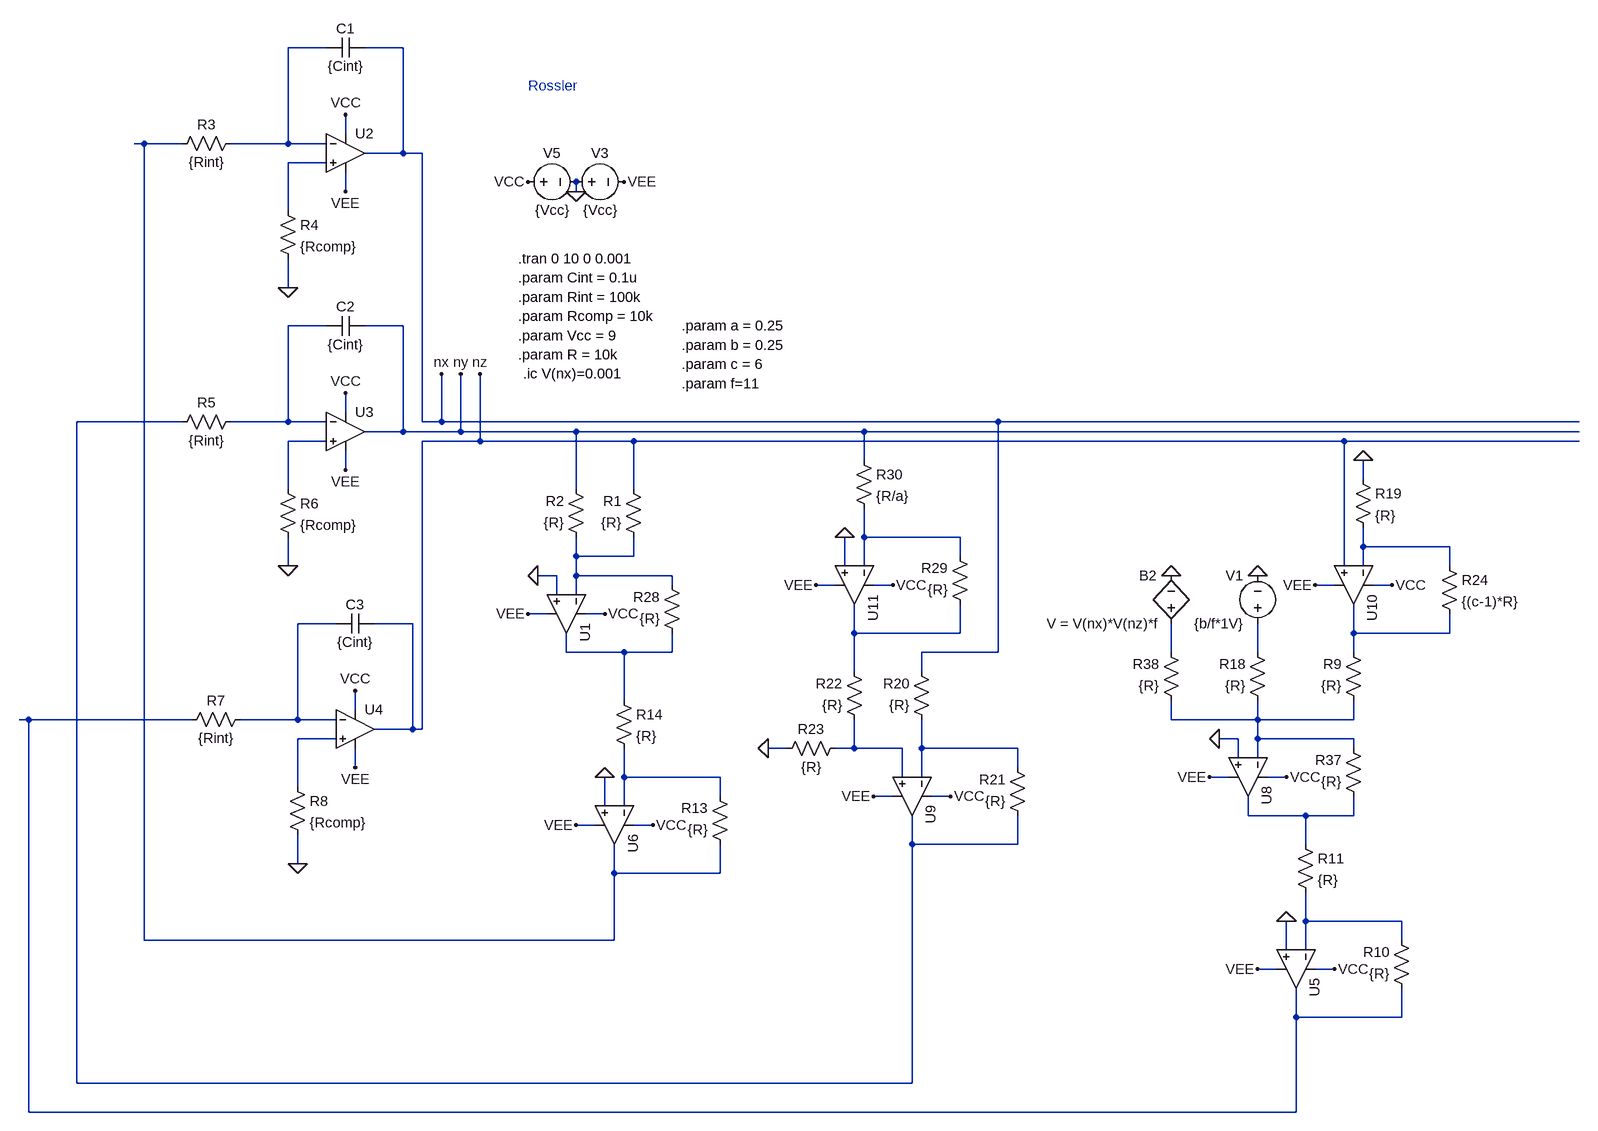
[diagram p0: schematic rossler.asc]
rossler.asc, the LTspice schematic file:
Version 4.1
SHEET 1 1572 5060
WIRE -2896 3184 -2960 3184
WIRE -2768 3184 -2832 3184
WIRE -2864 3328 -2864 3296
WIRE -3200 3344 -3216 3344
WIRE -3136 3344 -3200 3344
WIRE -2960 3344 -2960 3184
WIRE -2960 3344 -3056 3344
WIRE -2896 3344 -2960 3344
WIRE -2768 3360 -2768 3184
WIRE -2768 3360 -2832 3360
WIRE -2736 3360 -2768 3360
WIRE -2896 3376 -2960 3376
WIRE -2864 3424 -2864 3392
WIRE -2480 3424 -2480 3408
WIRE -2960 3456 -2960 3376
WIRE -2960 3584 -2960 3536
WIRE -2896 3648 -2960 3648
WIRE -2768 3648 -2832 3648
WIRE -2864 3792 -2864 3760
WIRE -3136 3808 -3312 3808
WIRE -2960 3808 -2960 3648
WIRE -2960 3808 -3056 3808
WIRE -2896 3808 -2960 3808
WIRE -2736 3808 -2736 3360
WIRE -2704 3808 -2704 3728
WIRE -2704 3808 -2736 3808
WIRE -1776 3808 -2704 3808
WIRE 192 3808 -1776 3808
WIRE -2768 3824 -2768 3648
WIRE -2768 3824 -2832 3824
WIRE -2672 3824 -2672 3728
WIRE -2672 3824 -2768 3824
WIRE -2480 3824 -2672 3824
WIRE -2000 3824 -2480 3824
WIRE 192 3824 -2000 3824
WIRE -2896 3840 -2960 3840
WIRE -2640 3840 -2640 3728
WIRE -2640 3840 -2736 3840
WIRE -2384 3840 -2640 3840
WIRE -1200 3840 -2384 3840
WIRE 192 3840 -1200 3840
WIRE -2000 3872 -2000 3824
WIRE -2864 3888 -2864 3856
WIRE -1168 3904 -1168 3872
WIRE -2960 3920 -2960 3840
WIRE -2480 3920 -2480 3824
WIRE -2384 3920 -2384 3840
WIRE -2000 4000 -2000 3952
WIRE -1840 4000 -2000 4000
WIRE -1168 4016 -1168 3984
WIRE -1024 4016 -1168 4016
WIRE -2480 4032 -2480 4000
WIRE -2384 4032 -2384 4000
WIRE -2384 4032 -2480 4032
WIRE -1840 4032 -1840 4000
WIRE -2960 4048 -2960 4000
WIRE -2032 4048 -2032 4000
WIRE -2000 4048 -2000 4000
WIRE -1200 4048 -1200 3840
WIRE -1168 4048 -1168 4016
WIRE -1024 4048 -1024 4016
WIRE -2512 4064 -2544 4064
WIRE -2480 4064 -2480 4032
WIRE -2320 4064 -2480 4064
WIRE -2320 4080 -2320 4064
WIRE -2048 4080 -2080 4080
WIRE -1952 4080 -1984 4080
WIRE -1216 4080 -1248 4080
WIRE -1120 4080 -1152 4080
WIRE -2512 4096 -2512 4064
WIRE -2480 4096 -2480 4064
WIRE -2528 4128 -2560 4128
WIRE -2432 4128 -2464 4128
WIRE -2880 4144 -2944 4144
WIRE -2752 4144 -2816 4144
WIRE -2016 4160 -2016 4112
WIRE -1840 4160 -1840 4112
WIRE -1840 4160 -2016 4160
WIRE -1184 4160 -1184 4112
WIRE -1024 4160 -1024 4128
WIRE -1024 4160 -1184 4160
WIRE -2496 4192 -2496 4160
WIRE -2400 4192 -2496 4192
WIRE -2320 4192 -2320 4160
WIRE -2320 4192 -2400 4192
WIRE -1776 4192 -1776 3808
WIRE -1776 4192 -1904 4192
WIRE -1488 4192 -1488 4144
WIRE -1344 4192 -1344 4144
WIRE -1184 4192 -1184 4160
WIRE -2016 4224 -2016 4160
WIRE -1904 4224 -1904 4192
WIRE -2400 4272 -2400 4192
WIRE -2848 4288 -2848 4256
WIRE -3392 4304 -3408 4304
WIRE -3120 4304 -3392 4304
WIRE -2944 4304 -2944 4144
WIRE -2944 4304 -3040 4304
WIRE -2880 4304 -2944 4304
WIRE -1488 4304 -1488 4272
WIRE -1344 4304 -1344 4272
WIRE -1344 4304 -1488 4304
WIRE -1184 4304 -1184 4272
WIRE -1184 4304 -1344 4304
WIRE -2752 4320 -2752 4144
WIRE -2752 4320 -2816 4320
WIRE -2736 4320 -2736 3840
WIRE -2736 4320 -2752 4320
WIRE -2880 4336 -2944 4336
WIRE -1376 4336 -1408 4336
WIRE -1344 4336 -1344 4304
WIRE -1184 4336 -1344 4336
WIRE -2128 4352 -2160 4352
WIRE -2016 4352 -2016 4304
WIRE -2016 4352 -2048 4352
WIRE -1936 4352 -2016 4352
WIRE -1904 4352 -1904 4304
WIRE -1744 4352 -1904 4352
WIRE -1184 4352 -1184 4336
WIRE -1376 4368 -1376 4336
WIRE -1344 4368 -1344 4336
WIRE -2848 4384 -2848 4352
WIRE -1744 4384 -1744 4352
WIRE -2400 4400 -2400 4352
WIRE -2240 4400 -2400 4400
WIRE -1936 4400 -1936 4352
WIRE -1904 4400 -1904 4352
WIRE -1392 4400 -1424 4400
WIRE -1296 4400 -1328 4400
WIRE -2944 4416 -2944 4336
WIRE -2240 4432 -2240 4400
WIRE -1952 4432 -1984 4432
WIRE -1856 4432 -1888 4432
WIRE -2432 4448 -2432 4400
WIRE -2400 4448 -2400 4400
WIRE -1360 4464 -1360 4432
WIRE -1264 4464 -1360 4464
WIRE -1184 4464 -1184 4432
WIRE -1184 4464 -1264 4464
WIRE -2448 4480 -2480 4480
WIRE -2352 4480 -2384 4480
WIRE -1920 4512 -1920 4464
WIRE -1744 4512 -1744 4464
WIRE -1744 4512 -1920 4512
WIRE -1264 4512 -1264 4464
WIRE -2944 4544 -2944 4496
WIRE -2416 4560 -2416 4512
WIRE -2240 4560 -2240 4512
WIRE -2240 4560 -2416 4560
WIRE -1264 4640 -1264 4592
WIRE -1104 4640 -1264 4640
WIRE -3200 4672 -3200 3344
WIRE -2416 4672 -2416 4560
WIRE -2416 4672 -3200 4672
WIRE -1104 4672 -1104 4640
WIRE -1296 4688 -1296 4640
WIRE -1264 4688 -1264 4640
WIRE -1312 4720 -1344 4720
WIRE -1216 4720 -1248 4720
WIRE -1280 4800 -1280 4752
WIRE -1104 4800 -1104 4752
WIRE -1104 4800 -1280 4800
WIRE -3312 4992 -3312 3808
WIRE -1920 4992 -1920 4512
WIRE -1920 4992 -3312 4992
WIRE -3392 5040 -3392 4304
WIRE -1280 5040 -1280 4800
WIRE -1280 5040 -3392 5040
FLAG -2480 3424 0
FLAG -2560 3408 VCC
FLAG -2400 3408 VEE
FLAG -2864 3296 VCC
FLAG -2864 3424 VEE
FLAG -2960 3584 0
FLAG -2864 3760 VCC
FLAG -2864 3888 VEE
FLAG -2960 4048 0
FLAG -2848 4256 VCC
FLAG -2848 4384 VEE
FLAG -2944 4544 0
FLAG -2704 3728 nx
FLAG -2672 3728 ny
FLAG -1488 4064 0
FLAG -2640 3728 nz
FLAG -2432 4128 VCC
FLAG -2560 4128 VEE
FLAG -2544 4064 0
FLAG -2352 4480 VCC
FLAG -2480 4480 VEE
FLAG -2432 4400 0
FLAG -1952 4080 VCC
FLAG -2080 4080 VEE
FLAG -2032 4000 0
FLAG -1856 4432 VCC
FLAG -1984 4432 VEE
FLAG -2160 4352 0
FLAG -1296 4400 VCC
FLAG -1424 4400 VEE
FLAG -1408 4336 0
FLAG -1344 4064 0
FLAG -1120 4080 VCC
FLAG -1248 4080 VEE
FLAG -1168 3872 0
FLAG -1216 4720 VCC
FLAG -1344 4720 VEE
FLAG -1296 4640 0
SYMBOL OpAmps\\UniversalOpAmp2 -2864 3360 R0
SYMATTR InstName U2
SYMATTR Value2 Avol=1Meg GBW=1Meg Slew=10Meg
SYMBOL res -3040 3328 R90
WINDOW 0 0 56 VBottom 2
WINDOW 3 32 56 VTop 2
SYMATTR InstName R3
SYMATTR Value {Rint}
SYMBOL voltage -2496 3408 R270
WINDOW 0 32 56 VTop 2
WINDOW 3 -32 56 VBottom 2
SYMATTR InstName V3
SYMATTR Value {Vcc}
SYMBOL voltage -2576 3408 R270
WINDOW 0 32 56 VTop 2
WINDOW 3 -32 56 VBottom 2
SYMATTR InstName V5
SYMATTR Value {Vcc}
SYMBOL res -2976 3440 R0
SYMATTR InstName R4
SYMATTR Value {Rcomp}
SYMBOL cap -2832 3168 R90
WINDOW 0 0 32 VBottom 2
WINDOW 3 32 32 VTop 2
SYMATTR InstName C1
SYMATTR Value {Cint}
SYMBOL OpAmps\\UniversalOpAmp2 -2864 3824 R0
SYMATTR InstName U3
SYMATTR Value2 Avol=1Meg GBW=1Meg Slew=10Meg
SYMBOL res -3040 3792 R90
WINDOW 0 0 56 VBottom 2
WINDOW 3 32 56 VTop 2
SYMATTR InstName R5
SYMATTR Value {Rint}
SYMBOL res -2976 3904 R0
SYMATTR InstName R6
SYMATTR Value {Rcomp}
SYMBOL cap -2832 3632 R90
WINDOW 0 0 32 VBottom 2
WINDOW 3 32 32 VTop 2
SYMATTR InstName C2
SYMATTR Value {Cint}
SYMBOL OpAmps\\UniversalOpAmp2 -2848 4320 R0
SYMATTR InstName U4
SYMATTR Value2 Avol=1Meg GBW=1Meg Slew=10Meg
SYMBOL res -3024 4288 R90
WINDOW 0 0 56 VBottom 2
WINDOW 3 32 56 VTop 2
SYMATTR InstName R7
SYMATTR Value {Rint}
SYMBOL res -2960 4400 R0
SYMATTR InstName R8
SYMATTR Value {Rcomp}
SYMBOL cap -2816 4128 R90
WINDOW 0 0 32 VBottom 2
WINDOW 3 32 32 VTop 2
SYMATTR InstName C3
SYMATTR Value {Cint}
SYMBOL bv -1488 4160 R180
WINDOW 0 24 96 Left 2
WINDOW 3 24 16 Left 2
SYMATTR InstName B2
SYMATTR Value V = V(nx)*V(nz)*f
SYMBOL res -2368 4016 R180
WINDOW 0 36 76 Left 2
WINDOW 3 36 40 Left 2
SYMATTR InstName R1
SYMATTR Value {R}
SYMBOL res -2464 4016 R180
WINDOW 0 36 76 Left 2
WINDOW 3 36 40 Left 2
SYMATTR InstName R2
SYMATTR Value {R}
SYMBOL OpAmps\\UniversalOpAmp2 -2496 4128 R90
SYMATTR InstName U1
SYMATTR Value2 Avol=1Meg GBW=1Meg Slew=10Meg
SYMBOL res -2304 4176 R180
WINDOW 0 36 76 Left 2
WINDOW 3 36 40 Left 2
SYMATTR InstName R28
SYMATTR Value {R}
SYMBOL OpAmps\\UniversalOpAmp2 -2416 4480 R90
SYMATTR InstName U6
SYMATTR Value2 Avol=1Meg GBW=1Meg Slew=10Meg
SYMBOL res -2224 4528 R180
WINDOW 0 36 76 Left 2
WINDOW 3 36 40 Left 2
SYMATTR InstName R13
SYMATTR Value {R}
SYMBOL res -2416 4256 R0
SYMATTR InstName R14
SYMATTR Value {R}
SYMBOL OpAmps\\UniversalOpAmp2 -2016 4080 R90
SYMATTR InstName U11
SYMATTR Value2 Avol=1Meg GBW=1Meg Slew=10Meg
SYMBOL res -1824 4128 R180
WINDOW 0 36 76 Left 2
WINDOW 3 36 40 Left 2
SYMATTR InstName R29
SYMATTR Value {R}
SYMBOL res -2016 3856 R0
SYMATTR InstName R30
SYMATTR Value {R/a}
SYMBOL OpAmps\\UniversalOpAmp2 -1920 4432 R90
SYMATTR InstName U9
SYMATTR Value2 Avol=1Meg GBW=1Meg Slew=10Meg
SYMBOL res -1888 4320 R180
WINDOW 0 36 76 Left 2
WINDOW 3 36 40 Left 2
SYMATTR InstName R20
SYMATTR Value {R}
SYMBOL res -1728 4480 R180
WINDOW 0 36 76 Left 2
WINDOW 3 36 40 Left 2
SYMATTR InstName R21
SYMATTR Value {R}
SYMBOL res -2000 4320 R180
WINDOW 0 36 76 Left 2
WINDOW 3 36 40 Left 2
SYMATTR InstName R22
SYMATTR Value {R}
SYMBOL res -2144 4368 R270
WINDOW 0 32 56 VTop 2
WINDOW 3 0 56 VBottom 2
SYMATTR InstName R23
SYMATTR Value {R}
SYMBOL res -1328 4288 R180
WINDOW 0 36 76 Left 2
WINDOW 3 36 40 Left 2
SYMATTR InstName R18
SYMATTR Value {R}
SYMBOL OpAmps\\UniversalOpAmp2 -1360 4400 R90
SYMATTR InstName U8
SYMATTR Value2 Avol=1Meg GBW=1Meg Slew=10Meg
SYMBOL res -1168 4448 R180
WINDOW 0 36 76 Left 2
WINDOW 3 36 40 Left 2
SYMATTR InstName R37
SYMATTR Value {R}
SYMBOL voltage -1344 4160 R180
WINDOW 0 24 96 Left 2
WINDOW 3 24 16 Left 2
SYMATTR InstName V1
SYMATTR Value {b/f*1V}
SYMBOL res -1472 4288 R180
WINDOW 0 36 76 Left 2
WINDOW 3 36 40 Left 2
SYMATTR InstName R38
SYMATTR Value {R}
SYMBOL OpAmps\\UniversalOpAmp2 -1184 4080 R90
SYMATTR InstName U10
SYMATTR Value2 Avol=1Meg GBW=1Meg Slew=10Meg
SYMBOL res -1184 3888 R0
SYMATTR InstName R19
SYMATTR Value {R}
SYMBOL res -1040 4032 R0
SYMATTR InstName R24
SYMATTR Value {(c-1)*R}
SYMBOL res -1168 4288 R180
WINDOW 0 36 76 Left 2
WINDOW 3 36 40 Left 2
SYMATTR InstName R9
SYMATTR Value {R}
SYMBOL OpAmps\\UniversalOpAmp2 -1280 4720 R90
SYMATTR InstName U5
SYMATTR Value2 Avol=1Meg GBW=1Meg Slew=10Meg
SYMBOL res -1088 4768 R180
WINDOW 0 36 76 Left 2
WINDOW 3 36 40 Left 2
SYMATTR InstName R10
SYMATTR Value {R}
SYMBOL res -1280 4496 R0
SYMATTR InstName R11
SYMATTR Value {R}
TEXT -2576 3568 Left 2 !.param Cint = 0.1u
TEXT -2576 3632 Left 2 !.param Rcomp = 10k
TEXT -2576 3600 Left 2 !.param Rint = 100k
TEXT -2576 3664 Left 2 !.param Vcc = 9
TEXT -2576 3536 Left 2 !.tran 0 10 0 0.001
TEXT -2576 3696 Left 2 !.param R = 10k
TEXT -2304 3648 Left 2 !.param a = 0.25
TEXT -2304 3680 Left 2 !.param b = 0.25
TEXT -2304 3712 Left 2 !.param c = 6
TEXT -2568 3728 Left 2 !.ic V(nx)=0.001
TEXT -2304 3744 Left 2 !.param f=11
TEXT -2560 3248 Left 2 ;Rossler

The netlist it stands for:
* rossler.asc
X§U2 N003 N001 VCC VEE nx level2 Avol=1Meg GBW=1Meg Slew=10Meg Ilimit=25m Rail=0 Vos=0 En=0 Enk=0 In=0 Ink=0 Rin=500Meg  ; pins In+ In- V+ V- OUT
R3 N001 N002 {Rint}
V3 0 VEE {Vcc}
V5 VCC 0 {Vcc}
R4 N003 0 {Rcomp}
C1 nx N001 {Cint}
X§U3 N006 N004 VCC VEE ny level2 Avol=1Meg GBW=1Meg Slew=10Meg Ilimit=25m Rail=0 Vos=0 En=0 Enk=0 In=0 Ink=0 Rin=500Meg  ; pins In+ In- V+ V- OUT
R5 N004 N005 {Rint}
R6 N006 0 {Rcomp}
C2 ny N004 {Cint}
X§U4 N018 N010 VCC VEE nz level2 Avol=1Meg GBW=1Meg Slew=10Meg Ilimit=25m Rail=0 Vos=0 En=0 Enk=0 In=0 Ink=0 Rin=500Meg  ; pins In+ In- V+ V- OUT
R7 N010 N016 {Rint}
R8 N018 0 {Rcomp}
C3 nz N010 {Cint}
B2 N014 0 V = V(nx)*V(nz)*f
R1 N009 nz {R}
R2 N009 ny {R}
X§U1 0 N009 VCC VEE N013 level2 Avol=1Meg GBW=1Meg Slew=10Meg Ilimit=25m Rail=0 Vos=0 En=0 Enk=0 In=0 Ink=0 Rin=500Meg  ; pins In+ In- V+ V- OUT
R28 N013 N009 {R}
X§U6 0 N021 VCC VEE N002 level2 Avol=1Meg GBW=1Meg Slew=10Meg Ilimit=25m Rail=0 Vos=0 En=0 Enk=0 In=0 Ink=0 Rin=500Meg  ; pins In+ In- V+ V- OUT
R13 N002 N021 {R}
R14 N013 N021 {R}
X§U11 0 N007 VCC VEE N011 level2 Avol=1Meg GBW=1Meg Slew=10Meg Ilimit=25m Rail=0 Vos=0 En=0 Enk=0 In=0 Ink=0 Rin=500Meg  ; pins In+ In- V+ V- OUT
R29 N011 N007 {R}
R30 ny N007 {R/a}
X§U9 N019 N020 VCC VEE N005 level2 Avol=1Meg GBW=1Meg Slew=10Meg Ilimit=25m Rail=0 Vos=0 En=0 Enk=0 In=0 Ink=0 Rin=500Meg  ; pins In+ In- V+ V- OUT
R20 N020 nx {R}
R21 N005 N020 {R}
R22 N019 N011 {R}
R23 0 N019 {R}
R18 N017 N015 {R}
X§U8 0 N017 VCC VEE N022 level2 Avol=1Meg GBW=1Meg Slew=10Meg Ilimit=25m Rail=0 Vos=0 En=0 Enk=0 In=0 Ink=0 Rin=500Meg  ; pins In+ In- V+ V- OUT
R37 N022 N017 {R}
V1 N015 0 {b/f*1V}
R38 N017 N014 {R}
X§U10 nz N008 VCC VEE N012 level2 Avol=1Meg GBW=1Meg Slew=10Meg Ilimit=25m Rail=0 Vos=0 En=0 Enk=0 In=0 Ink=0 Rin=500Meg  ; pins In+ In- V+ V- OUT
R19 0 N008 {R}
R24 N008 N012 {(c-1)*R}
R9 N017 N012 {R}
X§U5 0 N023 VCC VEE N016 level2 Avol=1Meg GBW=1Meg Slew=10Meg Ilimit=25m Rail=0 Vos=0 En=0 Enk=0 In=0 Ink=0 Rin=500Meg  ; pins In+ In- V+ V- OUT
R10 N016 N023 {R}
R11 N022 N023 {R}
.param Cint = 0.1u
.param Rcomp = 10k
.param Rint = 100k
.param Vcc = 9
.tran 0 10 0 0.001
.param R = 10k
.param a = 0.25
.param b = 0.25
.param c = 6
.ic V(nx)=0.001
.param f=11
* Rossler
.lib UniversalOpAmp2.lib
.backanno
.end